# EAGLE design untitled (EAGLE 9.2.2)
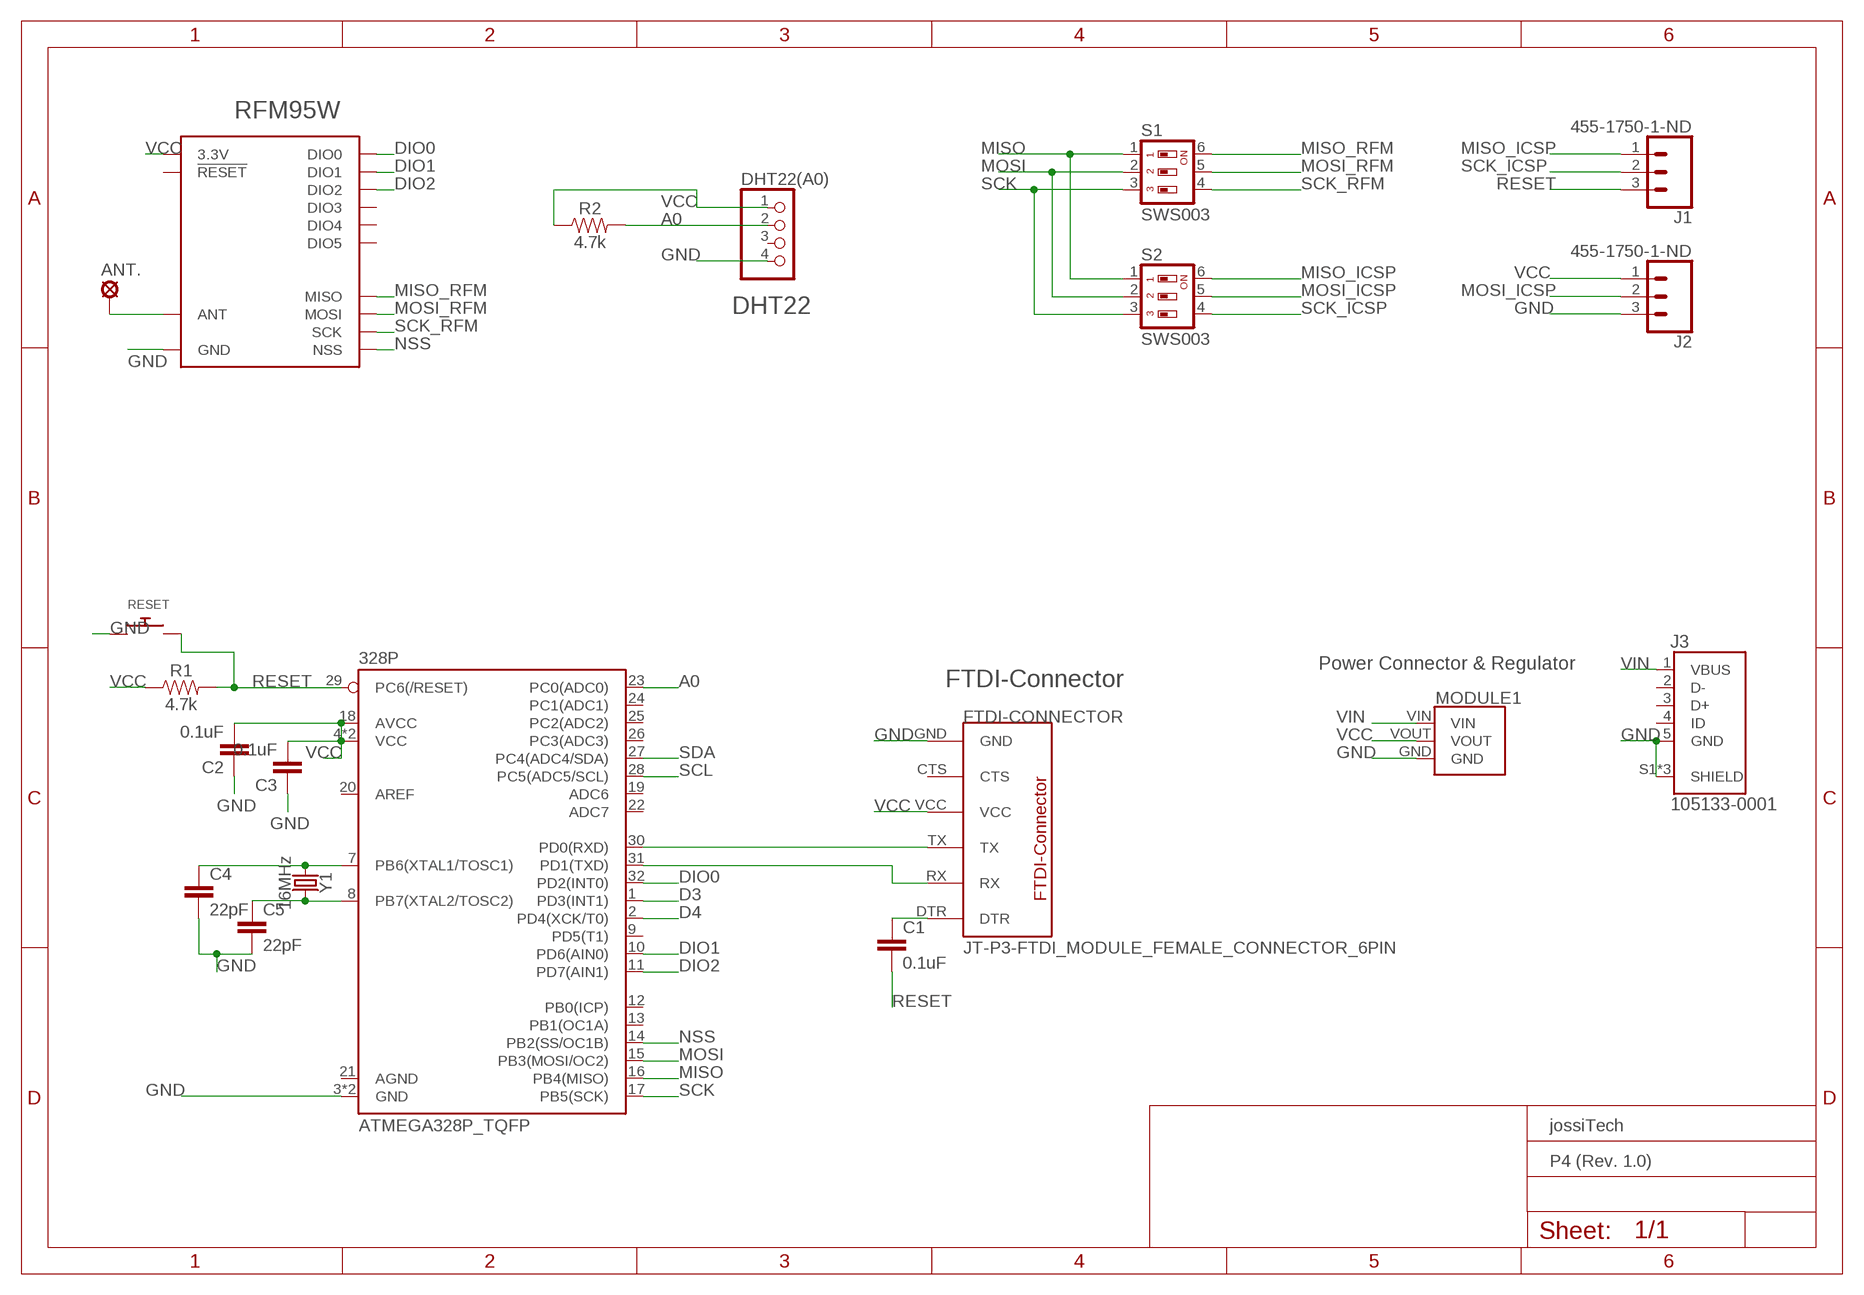
[diagram p0: schematic, sheet 1]
FRAME1 (A4L-LOC): COMPANY: jossiTech; PRODUCT: P4 (Rev. 1.0)

## Parts
328P  ATMEGA328P_TQFP  [TQFP32-08]
ANT.  LSP11  [LSP11]
C1  0.1uF  0.1UF-0603-25V-(+80/-20%)  [0603]
C2  0.1uF  0.1UF-0603-25V-(+80/-20%)  [0603]
C3  0.1uF  0.1UF-0603-25V-(+80/-20%)  [0603]
C4  22pF  22PF-0603-50V-5%  [0603]
C5  22pF  22PF-0603-50V-5%  [0603]
DHT22(A0)  PINHD-1X4  [1X04]
FTDI-CONNECTOR  JT-P3-FTDI_MODULE_FEMALE_CONNECTOR_6PIN  [JT-P3-FTDI_MODULE_FEMALE_CONNECTOR_6PIN]
J1  455-1750-1-ND  CONN_03  [1X03]
J2  455-1750-1-ND  CONN_03  [1X03]
J3  105133-0001  [MOLEX_105133-0001]
MODULE1  JT-P3-VOLTAGEREGULATOR  [JT-P3-VOLTAGEREGULATOR]
R1  4.7k  4.7KOHM-0603-1/10W-1%  [0603]
R2  4.7k  4.7KOHM-0603-1/10W-1%  [0603]
RESET  SWITCH_PUSHBUTTONEVQ-PE  [TACT_PANA-EVQ]
S1  SWS003  [SMS-003]
S2  SWS003  [SMS-003]
U2  RFM95W  [RFM95/96/97/98W]
Y1  16MHz  CRYSTAL-16MHZSMD-5X3.2  [CRYSTAL-SMD-5X3.2-4PAD]

## Nets
A0: 328P.23(PC0(ADC0)) DHT22(A0).2 R2.2
D3: 328P.1(PD3(INT1))
D4: 328P.2(PD4(XCK/T0))
DIO0: 328P.32(PD2(INT0)) U2.DIO0
DIO1: 328P.10(PD6(AIN0)) U2.DIO1
DIO2: 328P.11(PD7(AIN1)) U2.DIO2
GND: 328P.3(GND) 328P.5(GND) C2.1 C3.1 C4.2 C5.2 DHT22(A0).4 FTDI-CONNECTOR.GND J2.3 J3.5(GND) J3.S1(SHIELD) J3.S2(SHIELD) J3.S3(SHIELD) MODULE1.GND RESET.P$1 U2.GND@1(GND) U2.GND@2(GND) U2.GND@3(GND)
MISO: 328P.16(PB4(MISO)) S1.1 S2.1
MISO_ICSP: J1.1 S2.6
MISO_RFM: S1.6 U2.MISO
MOSI: 328P.15(PB3(MOSI/OC2)) S1.2 S2.2
MOSI_ICSP: J2.2 S2.5
MOSI_RFM: S1.5 U2.MOSI
N$1: ANT..MP U2.ANT
N$2: 328P.7(PB6(XTAL1/TOSC1)) C4.1 Y1.1
N$3: 328P.31(PD1(TXD)) FTDI-CONNECTOR.RX
N$4: 328P.30(PD0(RXD)) FTDI-CONNECTOR.TX
N$5: 328P.8(PB7(XTAL2/TOSC2)) C5.1 Y1.3
N$6: C1.1 FTDI-CONNECTOR.DTR
NSS: 328P.14(PB2(SS/OC1B)) U2.NSS
RESET: 328P.29(PC6(/RESET)) C1.2 J1.3 R1.2 RESET.P$2
SCK: 328P.17(PB5(SCK)) S1.3 S2.3
SCK_ICSP: J1.2 S2.4
SCK_RFM: S1.4 U2.SCK
SCL: 328P.28(PC5(ADC5/SCL))
SDA: 328P.27(PC4(ADC4/SDA))
VCC: 328P.4(VCC) 328P.6(VCC) 328P.18(AVCC) C2.2 C3.2 DHT22(A0).1 FTDI-CONNECTOR.VCC J2.1 MODULE1.VOUT R1.1 R2.1 U2.3.3V
VIN: J3.1(VBUS) MODULE1.VIN
Unconnected: 328P.9(PD5(T1)) 328P.12(PB0(ICP)) 328P.13(PB1(OC1A)) 328P.19(ADC6) 328P.20(AREF) 328P.21(AGND) 328P.22(ADC7) 328P.24(PC1(ADC1)) 328P.25(PC2(ADC2)) 328P.26(PC3(ADC3)) DHT22(A0).3 FTDI-CONNECTOR.CTS J3.2(D-) J3.3(D+) J3.4(ID) U2.!RESET U2.DIO3 U2.DIO4 U2.DIO5

## Notes on the sheet
- RFM95W
- DHT22
- Power Connector & Regulator
- FTDI-Connector

## Library data of the parts
328P = SparkFun-IC-Microcontroller:ATMEGA328P_TQFP: Popular 328P in QFP Storefront component: ATmega328 - TQFP <https://www.sparkfun.com/products/13448> (COM-13448) Datasheet <http://www.sparkfun.com/datasheets/Components/SMD/ATMega328.pdf> SparkFun Products SparkFun RedBoard - Programmed with Arduino <https://www.sparkfun.com/products/12757> (DEV-12757) Arduino Pro Mini 328 - 5V/16MHz <https://www.sparkfun.com/products/11113> (DEV-11113) Arduino Pro Mini 328 - 3.3V/8MHz <https://www.sparkfun.com/products/11114> (DEV-11114) SparkFun OpenLog <https://www.sparkfun.com/products/13712> (DEV-13712) SparkFun MicroView - OLED Arduino Module <https://www.sparkfun.com/products/12923> (DEV-12923) SparkFun Digital Sandbox <https://www.sparkfun.com/products/12651> (DEV-12651) SparkFun PicoBoard <https://www.sparkfun.com/products/11888> (WIG-11888) Arduino Fio <https://www.sparkfun.com/products/10116> (DEV-10116) LilyPad Arduino 328 Main Board <https://www.sparkfun.com/products/13342> (DEV-13342) SparkFun RedStick <https://www.sparkfun.com/products/13741> (DEV-13741) LilyPad MP3 <https://www.sparkfun.com/products/11013> (DEV-11013) LilyPad Arduino SimpleSnap <https://www.sparkfun.com/products/10941> (DEV-10941) SparkFun Stepoko <https://www.sparkfun.com/products/13899> (ROB-13899) SparkFun Geiger Counter <https://www.sparkfun.com/products/11345> (SEN-11345) SparkFun EL Sequencer <https://www.sparkfun.com/products/12781> (COM-12781) Arduino Pro 328 - 5V/16MHz <https://www.sparkfun.com/products/10915> (DEV-10915) CryptoCape <https://www.sparkfun.com/products/12773> (DEV-12773) SparkFun IR Thermometer Evaluation Board - MLX90614 <https://www.sparkfun.com/products/10740> (SEN-10740) SparkFun RedBot Mainboard <https://www.sparkfun.com/products/12097> (ROB-12097) Arduino Pro 328 - 3.3V/8MHz <https://www.sparkfun.com/products/10914> (DEV-10914) SparkFun Block for Intel® Edison - Arduino <https://www.sparkfun.com/products/13036> (DEV-13036) SparkFun Simon Says - Surface Mount Soldering Kit <https://www.sparkfun.com/products/10935> (KIT-10935) SparkFun 7-Segment Serial Display - Red <https://www.sparkfun.com/products/11441> (COM-11441) SparkFun 7-Segment Serial Display - White <https://www.sparkfun.com/products/11629> (COM-11629) SparkFun 7-Segment Serial Display - Yellow <https://www.sparkfun.com/products/11443> (COM-11443) SparkFun 7-Segment Serial Display - Kelly Green <https://www.sparkfun.com/products/11440> (COM-11440) SparkFun 7-Segment Serial Display - Blue <https://www.sparkfun.com/products/11442> (COM-11442) SparkFun OpenSegment Serial Display - 20mm (Blue) <https://www.sparkfun.com/products/11647> (COM-11647) SparkFun OpenSegment Serial Display - 20mm (Green) <https://www.sparkfun.com/products/11646> (COM-11646) SparkFun OpenSegment Serial Display - 20mm (White) <https://www.sparkfun.com/products/11648> (COM-11648) SparkFun OpenSegment Serial Display - 20mm (Red) <https://www.sparkfun.com/products/11644> (COM-11644) SparkFun OpenSegment Serial Display - 20mm (Yellow) <https://www.sparkfun.com/products/11645> (COM-11645) SparkFun OpenSegment Shield <https://www.sparkfun.com/products/13190> (DEV-13190); PROD_ID: IC-09069
ANT. = solpad:LSP11: SOLDER PAD drill 1.1 mm
C1-C3 = SparkFun-Capacitors:0.1UF: 0.1µF ceramic capacitors A capacitor is a passive two-terminal electrical component used to store electrical energy temporarily in an electric field.; PROD_ID: CAP-00810
C4 C5 = SparkFun-Capacitors:22PF: 22pF ceramic capacitors A capacitor is a passive two-terminal electrical component used to store electrical energy temporarily in an electric field.; PROD_ID: CAP-07876
DHT22(A0) = pinhead:PINHD-1X4: PIN HEADER
FTDI-CONNECTOR = JT-P3-FTDI_MODULE_FEMALE_CONNECTOR_6PIN:JT-P3-FTDI_MODULE_FEMALE_CONNECTOR_6PIN: FTDI_MODULE_FEMALE_CONNECTOR_6PIN
J1 J2 = SparkFun-Connectors:CONN_03: Multi connection point. Often used as Generic Header-pin footprint for 0.1 inch spaced/style header connections On any of the 0.1 inch spaced packages, you can populate with these: Break Away Headers - Straight <https://www.sparkfun.com/products/116> (PRT-00116) Break Away Male Headers - Right Angle <https://www.sparkfun.com/products/553> (PRT-00553) Female Headers <https://www.sparkfun.com/products/115> (PRT-00115) Break Away Headers - Machine Pin <https://www.sparkfun.com/products/117> (PRT-00117) Break Away Female Headers - Swiss Machine Pin <https://www.sparkfun.com/products/743> (PRT-00743) Stackable Header - 3 Pin (Female, 0.1") <https://www.sparkfun.com/products/13875> (PRT-13875) For SCREWTERMINALS and SPRING TERMINALS visit here: Screw Terimnals on SparkFun.com <https://www.sparkfun.com/search/results?term=Screw+Terminals> (5mm/3.5mm/2.54mm spacing) This device is also useful as a general connection point to wire up your design to another part of your project. Our various solder wires solder well into these plated through hole pads. Hook-Up Wire - Assortment (Stranded, 22 AWG) <https://www.sparkfun.com/products/11375> (PRT-11375) Hook-Up Wire - Assortment (Solid Core, 22 AWG) <https://www.sparkfun.com/products/11367> (PRT-11367) View the entire wire category on our website here <https://www.sparkfun.com/categories/141> Special notes: Molex polarized connector foot print use with SKU : PRT-08232 with associated crimp pins and housings.; PROD_ID: XXX-00000
J3 = 105133-0001:105133-0001: Conn Micro USB Type B RCP 5 POS 0.65mm Solder RA SMD 5 Terminal 1 Port Embossed T/R; AVAILABILITY: Unavailable; DESCRIPTION: USB Connectors MICRO USB B RECPT VERTICAL; MF: Molex; MP: 105133-0001; PACKAGE: None; PRICE: None
MODULE1 = JT-P3-VoltageRegulator:JT-P3-VOLTAGEREGULATOR: Voltage Regulator from Aliexpress VIN=4.75V - 12V VOUT=3.3V Max Current 800mA
R1 R2 = SparkFun-Resistors:4.7KOHM: 4.7kΩ resistor A resistor is a passive two-terminal electrical component that implements electrical resistance as a circuit element. Resistors act to reduce current flow, and, at the same time, act to lower voltage levels within circuits. - Wikipedia; PROD_ID: RES-07857
RESET = adafruit:SWITCH_PUSHBUTTON: Buttons SOFTTOUCHSMD_SJ - Soft touch temporary push button (Super Junk Akihabara) Compatible with SKPMANE010 [Mouser: 688-SKPMAN] C&K_KSS = Digikey: KSS221GLFS
S1 S2 = smd-special:SWS003: SMD Dip Switch 3 pol.
U2 = SparkFun-RF:RFM95W: RFM95/96/97/98 The RFM95/96/97/98(W) transceivers feature the LoRaTM long range modem that provides ultra-long range spread spectrum communication and high interference immunity whilst minimising current consumption. These devices also support high performance (G)FSK modes for systems including WMBus, IEEE802.15.4g. The RFM95/96/97/98(W) deliver exceptional phase noise, selectivity, receiver linearity and IIP3 for significantly lower current consumption than competing devices Datasheet <http://www.hoperf.com/upload/rf/RFM95_96_97_98W.pdf>; PROD_ID: IC-13959
Y1 = SparkFun-Clocks:CRYSTAL-16MHZ: 16MHz Crystal Digikey Example <http://www.digikey.com/product-search/en?keywords=535-9122-1-ND> Frequency: 16MHz Frequency Stability: ±50ppm Frequency Tolerance: ±20ppm Load Capacitance: 18pF SparkFun Products: Pro Micro -5V/16MHz <https://www.sparkfun.com/products/12640> SparkFun Serial Enabled LCD Kit <https://www.sparkfun.com/products/10097>; PROD_ID: XTAL-08218; SF_ID: COM-00094

## Board
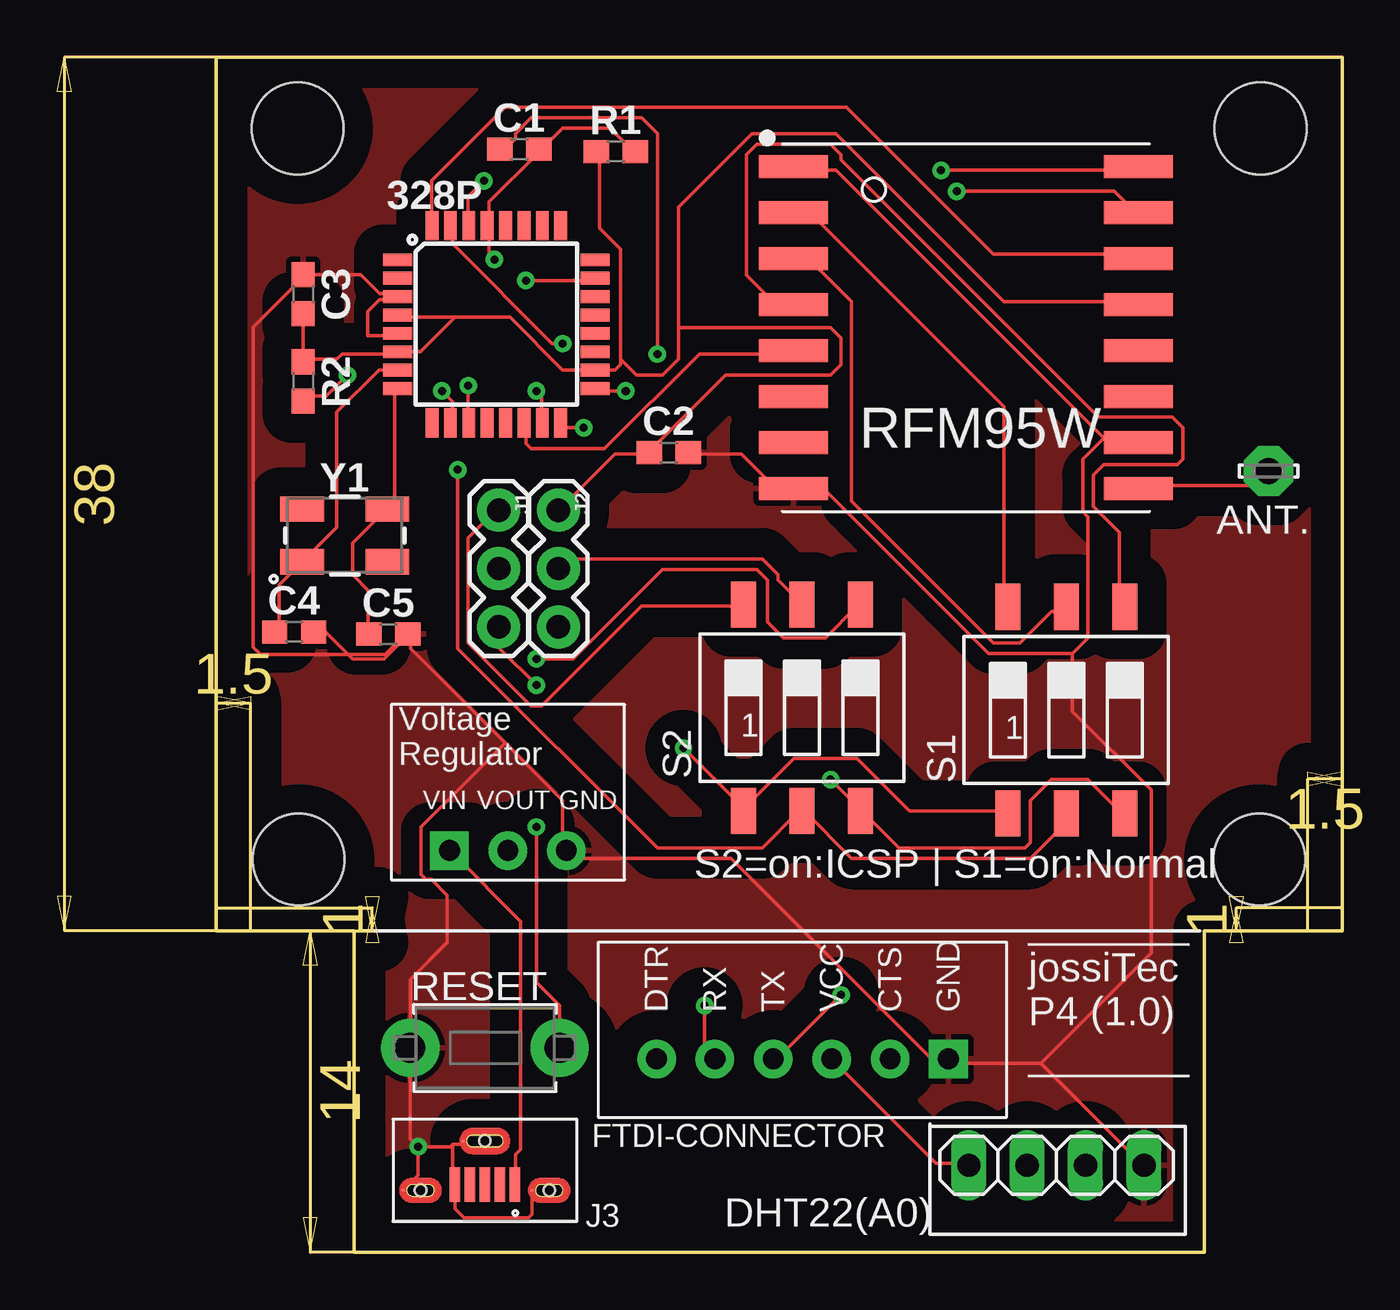
[diagram p1: board, top side]
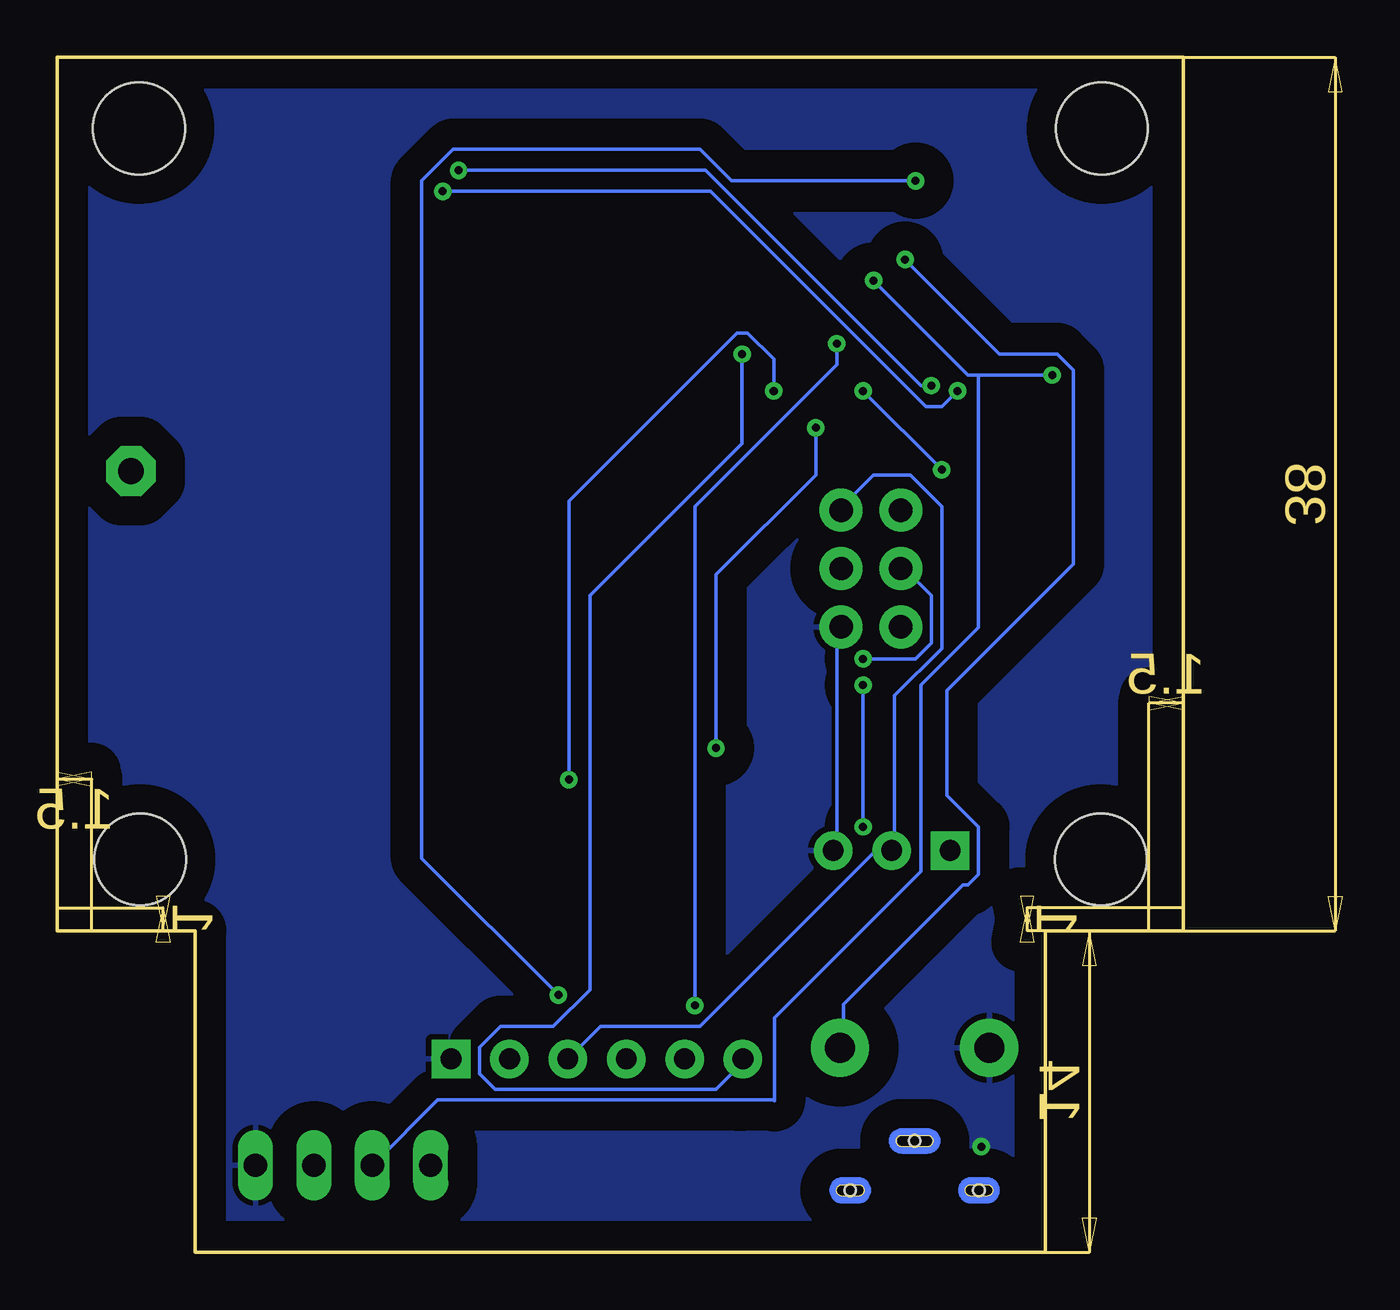
[diagram p2: board, bottom side, seen from below]

Size 49 x 52 mm. Coordinates in mm from the lower left corner, seen from the top.
Outline: 43,0 43,14 49,14 49,52 0,52 0,14 6,14 6,0 43,0
Copper layers (1*16): Top 0.035mm / dielectric 1.5mm / Bottom 0.035mm
Design rules "default *": minimum track width 6mil, minimum drill 0.35mm, track to track 12mil, track to pad 12mil, pad to pad 12mil, via to via 12mil, smd to smd 12mil, copper to edge 40mil, drill to drill 12mil, minimum pad ring 10mil, minimum via ring 8mil, stop-mask expansion 4mil, vias tented up to drill 0mil, thermal gap 10mil
Holes 4 mm at 3.6,17.1 3.55,48.91 45.45,48.91 45.4,17.1

### Footprints (pad centres in the part's own frame; a part is rotated, then mirrored left to right if it is on the bottom)
TQFP32-08 = smd 1.27 x 0.559: 1 -4.293,2.8; 2 -4.293,2; 3 -4.293,1.2; 4 -4.293,0.4; 5 -4.293,-0.4; 6 -4.293,-1.2; 7 -4.293,-2; 8 -4.293,-2.8; 17 4.293,-2.8; 18 4.293,-2; 19 4.293,-1.2; 20 4.293,-0.4; 21 4.293,0.4; 22 4.293,1.2; 23 4.293,2; 24 4.293,2.8 | smd 0.559 x 1.27: 9 -2.8,-4.293; 10 -2,-4.293; 11 -1.2,-4.293; 12 -0.4,-4.293; 13 0.4,-4.293; 14 1.2,-4.293; 15 2,-4.293; 16 2.8,-4.293; 25 2.8,4.293; 26 2,4.293; 27 1.2,4.293; 28 0.4,4.293; 29 -0.4,4.293; 30 -1.2,4.293; 31 -2,4.293; 32 -2.8,4.293
LSP11 = drill 1.118 pad 2.159 octagon: MP 0,0
0603 = smd 1.1 x 1: 1 -0.85,0; 2 0.85,0
1X04 = drill 1.016 long: 1 -3.81,0; 2 -1.27,0; 3 1.27,0; 4 3.81,0
JT-P3-FTDI_MODULE_FEMALE_CONNECTOR_6PIN = drill 0.9 pad 1.676: CTS -11.43,3.81; DTR -1.27,3.81; RX -3.81,3.81; TX -6.35,3.81; VCC -8.89,3.81 | drill 0.9 pad 1.676 square: GND -13.97,3.81
1X03 = drill 1.016 pad 1.88: 1 0,0; 2 2.54,0; 3 5.08,0
MOLEX_105133-0001 = smd 0.45 x 1.5: 1 -1.3,-0.25; 2 -0.65,-0.25; 3 0,-0.25; 4 0.65,-0.25; 5 1.3,-0.25 | smd 0.1 x 0.1: S1 -2.05,0; S2 3.55,0; S3 0.95,-2.15 | hole 0.5: -2.8,0; 2.8,0; 0,-2.15
JT-P3-VOLTAGEREGULATOR = drill 0.9 pad 1.676: GND 2.54,-3.81; VOUT 0,-3.81 | drill 0.9 pad 1.676 square: VIN -2.54,-3.81
TACT_PANA-EVQ = drill 1.3 pad 2.54: P$1 -3.25,0; P$2 3.25,0
SMS-003 = smd 1.092 x 2.007: 1 -2.54,-4.496; 2 0,-4.496; 3 2.54,-4.496; 4 2.54,4.496; 5 0,4.496; 6 -2.54,4.496
RFM95/96/97/98W = smd 3 x 1: 3.3V 7.5,1; !RESET -7.5,-3; ANT 7.5,-7; DIO0 7.5,3; DIO1 7.5,5; DIO2 7.5,7; DIO3 7.5,-3; DIO4 7.5,-1; DIO5 -7.5,-5; GND@1 -7.5,7; GND@2 -7.5,-7; GND@3 7.5,-5; MISO -7.5,5; MOSI -7.5,3; NSS -7.5,-1; SCK -7.5,1
CRYSTAL-SMD-5X3.2-4PAD = smd 1.9 x 1.1: 1 -1.85,-1.15; 2 1.85,-1.15; 3 1.85,1.15; 4 -1.85,1.15

### Placement (x,y rotation side)
328P  12.2,40.39 0 top
ANT.  45.8,34 0 top
C1  13.2,48 0 top
C2  19.7,34.8 180 top
C3  3.8,41.7 270 top
C4  3.4,27 0 top
C5  7.5,26.9 0 top
DHT22(A0)  36.57,3.79 0 top
FTDI-CONNECTOR  17.9,12.23 180 top
J1  12.3,32.3 270 top
J2  14.9,32.3 270 top
J3  11.7,2.7 180 top
MODULE1  12.7,21.3 0 top
R1  17.4,47.9 0 top
R2  3.8,37.9 270 top
RESET  11.7,8.9 0 top
S1  37,23.6 0 top
S2  25.5,23.7 0 top
U2  32.63,40.24 0 top
Y1  5.6,31.2 0 top

### Tracks (layer width: path | path; a pad name or v marks a point on that pad's centre or on a via)
A0  (via drill 0.35)
  Top 0.152: v5.71,38.18 4.8,37.26 3.89,37.26 R2.2 | v13.49,42.29 16.46,42.29 328P.23
  Bottom 0.152: 8.91,38.18 9.37,38.18 v13.49,42.29 | 8.91,38.18 v5.71,38.18 | 8.91,38.18 8.91,27.2 11.43,24.69 11.43,16.57 17.8,10.2 17.8,6.6 17.83,6.63 19.2,6.63 19.4,6.63 32.46,6.63 35.2,3.89 DHT22(A0).2
DIO0
  Top 0.152: 328P.32 9.37,44.81 9.37,46.63 12.57,49.84 27.43,49.84 33.83,43.43 40.01,43.43 U2.DIO0
DIO1  (via drill 0.35)
  Top 0.152: v9.83,37.49 10.29,37.03 10.29,36.12 328P.10 | v32.23,46.18 39.09,46.18 40.01,45.26 U2.DIO1
  Bottom 0.152: v9.83,37.49 10.52,36.8 11.2,36.8 20.57,46.18 v32.23,46.18
DIO2  (via drill 0.35)
  Top 0.152: v10.97,37.72 10.97,36.12 328P.11 | v31.55,47.09 40.01,47.09 U2.DIO2
  Bottom 0.152: v10.97,37.72 11.43,37.72 20.8,47.09 v31.55,47.09
GND  (via drill 0.35)
  Top 0.152: C2.1 20.57,34.75 22.86,34.75 24.23,33.38 24.92,33.38 U2.GND@2 25.15,33.15 26.52,33.15 33.6,26.06 37.26,26.06 | 38.63,35.43 26.98,47.09 25.15,47.09 U2.GND@1 | 38.63,35.43 40.01,35.43 U2.GND@3 38.63,35.43 | 37.26,26.06 37.95,26.75 37.95,32 37.72,32.23 37.72,34.52 38.63,35.43 | 35.89,8.23 40.23,3.89 DHT22(A0).4 | 35.89,8.23 32,8.23 FTDI-CONNECTOR.GND 31.77,8.46 31.09,8.46 22.4,17.14 15.54,17.14 15.32,17.37 MODULE1.GND 15.09,17.6 15.09,19.66 12.57,22.17 | 10.29,4.7 10.29,3.12 J3.5 10.4,1.9 10.8,1.5 13.6,1.5 13.75,1.65 J3.S1 | C4.2 4.34,26.98 4.8,26.98 5.94,25.83 7.32,25.83 8.23,26.75 C5.2 | 12.57,22.17 8.46,26.29 8.46,26.75 C5.2 | 12.57,22.17 8.91,18.52 8.91,16.46 9.14,16.23 9.37,16.23 10.06,15.54 10.06,13.49 8.46,11.89 RESET.P$1 8.45,4.95 v8.8,4.6 | 37.26,26.06 37.26,23.55 40.69,20.12 40.69,13.03 35.89,8.23 | J3.S3 10.6,4.7 10.29,4.7 | 10.29,4.7 10.19,4.6 v8.8,4.6 | J3.S2 8.8,3.35 v8.8,4.6 | 328P.5 7.82,39.9 6.6,39.9 6.6,40.94 7.12,41.45 7.77,41.45 328P.3 7.77,41.73 7.12,41.73 6.29,42.55 C3.1 3.8,42.44 1.62,40.26 1.62,26.34 1.94,26.02 7.36,26.02 8.24,26.9 C5.2
  Bottom 0.152: J2.3 15.09,27.2 15.09,17.6 MODULE1.GND
  pour Top (isolate 1.27): 0.4,51.8 0.4,14.3 6.4,14.3 6.4,0.4 42.8,0.4 42.8,14.3 48.8,14.3 48.8,51.8 48.7,51.9 0.4,51.9
  pour Bottom (isolate 1.27): 0.4,51.7 0.4,14.5 0.5,14.4 6.5,14.4 6.5,0.7 6.8,0.4 7,0.2 42.8,0.2 42.8,14.1 42.7,14.2 48.7,14.2 48.8,14.3 48.8,51.7
MISO  (via drill 0.35)
  Top 0.152: v16,35.89 15.09,35.89 328P.16 | v20.34,21.95 22.86,19.43 S2.1 23.09,19.43 25.15,21.49 27.89,21.49 30.18,19.2 34.29,19.2 S1.1
  Bottom 0.152: v16,35.89 16,33.83 20.34,29.49 v20.34,21.95
MISO_ICSP
  Top 0.152: S2.6 22.86,28.12 18.52,28.12 14.17,23.77 13.72,23.77 10.97,26.52 10.97,31.09 12.12,32.23 J1.1
MISO_RFM
  Top 0.152: S1.6 34.29,28.12 34.29,36.8 26.06,45.03 25.15,45.03 U2.MISO
MOSI  (via drill 0.35)
  Top 0.152: v13.95,37.49 14.17,37.26 14.17,36.12 328P.15 | v10.52,34.06 10.52,26.29 19.2,17.6 23.77,17.6 25.38,19.2 S2.2 25.6,19.2 27.66,17.14 35.43,17.14 36.8,18.52 36.8,18.97 S1.2
  Bottom 0.152: v10.52,34.06 v13.95,37.49
MOSI_ICSP
  Top 0.152: S2.5 25.38,28.35 24.46,29.26 24.46,29.49 23.77,30.18 15.32,30.18 15.09,29.95 J2.2
MOSI_RFM
  Top 0.152: S1.5 36.8,27.89 36.35,27.89 34.98,26.52 33.83,26.52 27.66,32.69 27.66,41.38 25.83,43.2 25.15,43.2 U2.MOSI
N$1
  Top 0.152: U2.ANT 40.23,33.38 45.26,33.38 45.72,33.83 ANT..MP
N$2
  Top 0.152: C4.1 2.74,27.2 2.74,29.03 3.66,29.95 Y1.1 3.89,30.18 5.26,31.55 5.26,36.58 7.09,38.41 7.77,38.41 328P.7
N$3  (via drill 0.35)
  Top 0.152: v15.09,39.55 14.63,39.55 10.29,43.89 10.29,44.58 328P.31 | v21.26,10.74 21.26,8.69 21.49,8.46 FTDI-CONNECTOR.RX
  Bottom 0.152: v15.09,39.55 15.09,38.63 21.26,32.46 v21.26,10.74
N$4  (via drill 0.35)
  Top 0.152: v11.66,46.63 10.97,45.95 10.97,44.81 328P.30 | v27.2,11.2 24.46,8.46 FTDI-CONNECTOR.TX
  Bottom 0.152: v11.66,46.63 19.66,46.63 21.03,48.01 31.77,48.01 33.15,46.63 33.15,17.14 v27.2,11.2
N$5
  Top 0.152: C5.1 6.63,26.98 6.63,28.8 5.94,29.49 5.94,30.86 7.32,32.23 Y1.3 7.54,32.46 7.77,32.69 7.77,37.49 328P.8
N$6  (via drill 0.35)
  Top 0.152: v19.2,39.09 19.2,48.69 18.52,49.38 13.72,49.38 13.03,48.69 13.03,48.46 12.57,48.01 C1.1
  Bottom 0.152: v19.2,39.09 19.2,35.2 25.83,28.57 25.83,11.43 27.43,9.83 29.72,9.83 30.63,8.91 30.63,7.77 29.95,7.09 20.34,7.09 19.2,8.23 FTDI-CONNECTOR.DTR
NSS
  Top 0.152: 328P.14 13.49,35.89 13.49,35.2 13.72,34.98 16.92,34.98 21.03,39.09 24.92,39.09 U2.NSS
RESET  (via drill 0.35)
  Top 0.152: R1.2 18.06,48.01 17.14,48.92 15.09,48.92 14.17,48.01 C1.2 13.95,47.78 11.89,45.72 11.89,44.81 328P.29 11.89,44.58 11.89,43.43 v12.12,43.2 | v13.95,24.69 12.34,26.29 12.34,27.2 J1.3 | v13.95,18.52 13.95,11.75 14.95,10.75 RESET.P$2
  Bottom 0.152: v13.95,18.52 v13.95,24.69 | v12.12,43.2 8,39.09 5.49,39.09 4.8,38.41 4.8,29.95 10.29,24.46 10.29,19.89 8.91,18.52 8.91,16.46 9.37,16 9.6,16 14.8,10.8 14.8,9.05 RESET.P$2
SCK  (via drill 0.35)
  Top 0.152: v17.83,37.49 16.69,37.49 328P.17 | v26.75,20.57 27.89,19.43 S2.3 28.12,19.2 29.72,17.6 35.2,17.6 35.43,17.83 35.43,19.66 36.35,20.57 37.95,20.57 39.32,19.2 S1.3
  Bottom 0.152: v17.83,37.49 17.83,38.86 18.97,40.01 19.43,40.01 26.75,32.69 v26.75,20.57
SCK_ICSP  (via drill 0.35)
  Top 0.152: v13.95,25.83 15.54,25.83 19.43,29.72 23.55,29.72 24,29.26 24,27.43 24.69,26.75 26.52,26.75 27.89,28.12 S2.4
  Bottom 0.152: v13.95,25.83 11.66,25.83 10.97,26.52 10.97,28.57 12.12,29.72 J1.2
SCK_RFM
  Top 0.152: S1.4 39.32,28.12 39.32,31.32 38.18,32.46 38.18,33.83 38.63,34.29 41.83,34.29 42.06,34.52 42.06,35.89 41.6,36.35 38.41,36.35 27.2,47.55 27.2,47.78 26.75,48.23 23.55,48.23 23.09,47.78 23.09,42.52 24.23,41.38 24.92,41.38 U2.SCK
VCC
  Top 0.152: DHT22(A0).1 32.69,3.89 31.32,3.89 26.98,8.23 FTDI-CONNECTOR.VCC | J2.1 15.09,32.46 17.37,34.75 18.75,34.75 C2.2 18.97,34.98 22.17,38.18 26.75,38.18 27.2,38.63 27.2,39.78 26.75,40.23 20.12,40.23 | 3.9,38.86 5.26,38.86 5.49,39.09 7.77,39.09 328P.6 8.9,39.19 10.4,40.69 | 3.9,38.86 3.89,38.86 R2.1 | 17.6,38.86 17.6,38.63 17.37,38.41 16.69,38.41 328P.18 16.46,38.41 15.09,38.41 12.8,40.69 10.4,40.69 | 17.6,38.86 17.6,43.66 16.69,44.58 16.69,47.78 R1.1 | 20.12,40.23 20.12,38.86 19.43,38.18 18.29,38.18 17.6,38.86 | 20.12,40.23 20.12,45.49 23.32,48.69 26.98,48.69 34.29,41.38 40.01,41.38 U2.3.3V | 10.4,40.69 8,40.69 328P.4 | 3.9,38.86 3.8,38.96 C3.2
  Bottom 0.152: FTDI-CONNECTOR.VCC 26.75,8.46 25.38,9.83 21.03,9.83 13.49,17.37 12.8,17.37 MODULE1.VOUT 12.57,17.6 12.57,24.23 10.52,26.29 10.52,32.46 11.89,33.83 13.49,33.83 14.86,32.46 J2.1
VIN
  Top 0.152: J3.1 13.03,3.12 13.03,4.26 13.26,4.49 13.26,14.4 10.29,17.37 MODULE1.VIN

### Text on the board
tPlace: RFM95W | S2=on:ICSP | S1=on:Normal | _______ / jossiTec / P4 (1.0) / _______